# Altium schematic sheet Connectors.SchDoc
size A3; SheetNumber: 5; SheetTotal: 5
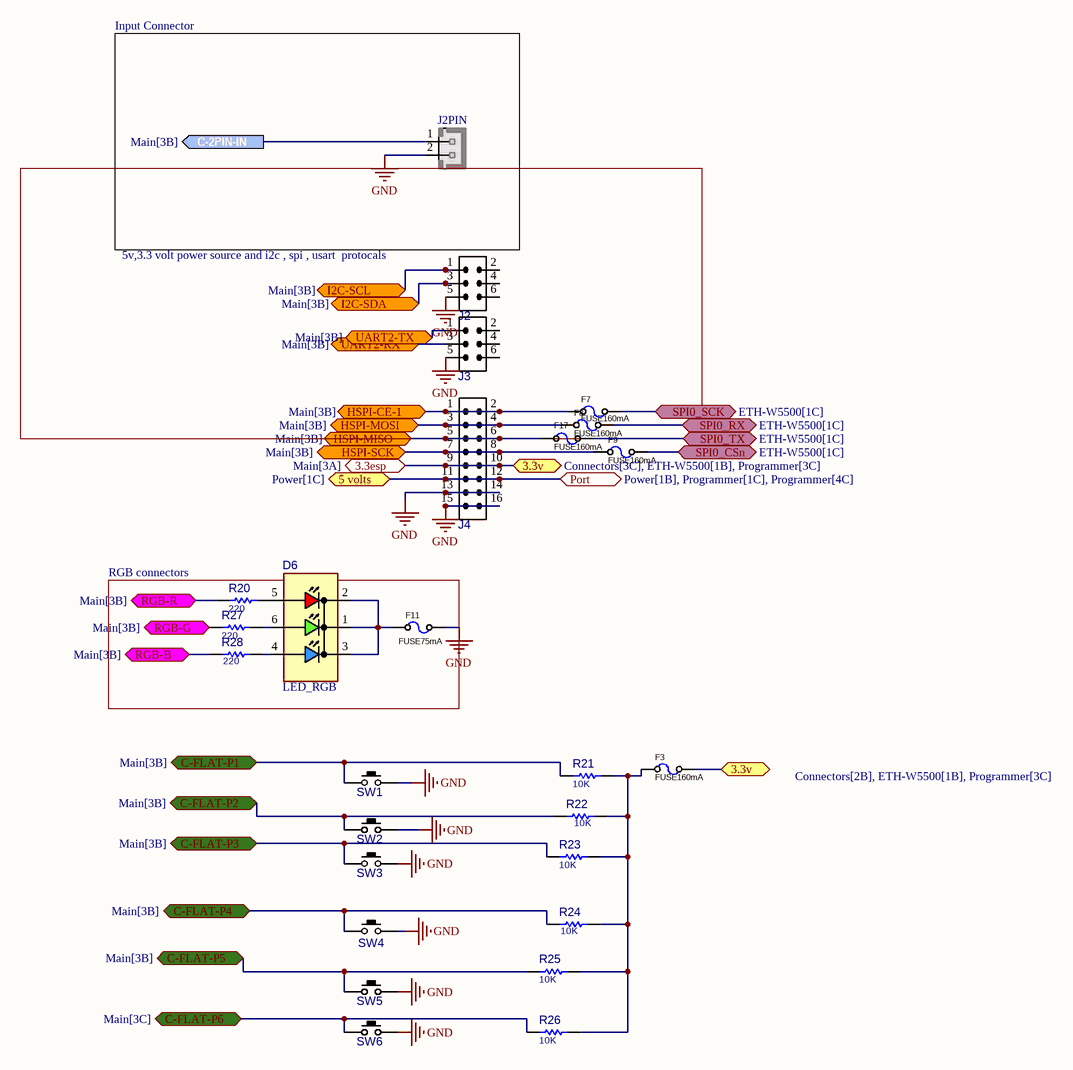
[diagram p0: Connectors.SchDoc]

## Parts
D6  LED_RGB  [LED5050RGB_6]
F3  FUSE160mA  [F1206]
F7  FUSE160mA  [F1206]
F8  FUSE160mA  [F1206]
F9  FUSE160mA  [F1206]
F11  FUSE75mA  [F1206]
F17  FUSE160mA  [F1206]
J2  IDC_2X3  [IDC_2X3]  (value not drawn)
J2PIN  HHDR_2  [XH_2]  (value not drawn)
J3  IDC_2X3  [IDC_2X3]  (value not drawn)
J4  IDC_2X8  [IDC_2X8]  (value not drawn)
R20  220  [R0402]
R21  10K  [R0402]
R22  10K  [R0402]
R23  10K  [R0402]
R24  10K  [R0402]
R25  10K  [R0402]
R26  10K  [R0402]
R27  220  [R0402]
R28  220  [R0402]
SW1  PUSHBUTTON  [SWPBS_SPST_6X3X5]  (value not drawn)
SW2  PUSHBUTTON  [SWPBS_SPST_6X3X5]  (value not drawn)
SW3  PUSHBUTTON  [SWPBS_SPST_6X3X5]  (value not drawn)
SW4  PUSHBUTTON  [SWPBS_SPST_6X3X5]  (value not drawn)
SW5  PUSHBUTTON  [SWPBS_SPST_6X3X5]  (value not drawn)
SW6  PUSHBUTTON  [SWPBS_SPST_6X3X5]  (value not drawn)

## Blocks framed on the sheet
Input Connector: J2PIN
5v,3.3 volt power source and i2c , spi , usart  protocals: F7 F8 F17 J2 J3
RGB connectors: D6 F11 R20 R27 R28

## Ports
3.3esp (bidir, see Main[3A]), 3.3v (bidir, see Connectors[2B], ETH-W5500[1B], Programmer[3C]), 3.3v (bidir, see Connectors[3C], ETH-W5500[1B], Programmer[3C]), 5 volts (bidir, see Power[1C]), C-2PIN-IN (out, see Main[3B]), C-FLAT-P1 (bidir, see Main[3B]), C-FLAT-P2 (bidir, see Main[3B]), C-FLAT-P3 (bidir, see Main[3B]), C-FLAT-P4 (bidir, see Main[3B]), C-FLAT-P5 (bidir, see Main[3B]), C-FLAT-P6 (bidir, see Main[3C]), HSPI-CE-1 (bidir, see Main[3B]), HSPI-MISO (bidir, see Main[3B]), HSPI-MOSI (bidir, see Main[3B]), HSPI-SCK (bidir, see Main[3B]), I2C-SCL (bidir, see Main[3B]), I2C-SDA (bidir, see Main[3B]), Port (bidir, see Power[1B], Programmer[1C], Programmer[4C]), RGB-B (bidir, see Main[3B]), RGB-G (bidir, see Main[3B]), RGB-R (bidir, see Main[3B]), SPI0_CSn (bidir, see ETH-W5500[1C]), SPI0_RX (bidir, see ETH-W5500[1C]), SPI0_SCK (bidir, see ETH-W5500[1C]), SPI0_TX (bidir, see ETH-W5500[1C]), UART2-RX (bidir, see Main[3B]), UART2-TX (bidir, see Main[3B])

## Nets
GND: F11.2 J2.5 J2PIN.2 J3.5 J4.13 J4.14 J4.15 J4.16 SW1.2(P3) SW2.2(P3) SW3.2(P3) SW4.2(P3) SW5.2(P3) SW6.2(P3)
3.3esp: F3.2 J4.9 J4.10 ; port 3.3v, port 3.3esp
5 volts: J4.11 J4.12 ; port 5 volts, port Port
C-2PIN-IN: J2PIN.1 ; port C-2PIN-IN
C-FLAT-P1: R21.1 SW1.1(P1) ; port C-FLAT-P1
C-FLAT-P2: R22.1 SW2.1(P1) ; port C-FLAT-P2
C-FLAT-P3: R23.1 SW3.1(P1) ; port C-FLAT-P3
C-FLAT-P4: R24.1 SW4.1(P1) ; port C-FLAT-P4
C-FLAT-P5: R25.1 SW5.1(P1) ; port C-FLAT-P5
C-FLAT-P6: R26.1 SW6.1(P1) ; port C-FLAT-P6
HSPI-CE-1: F7.2 J4.1 J4.2 ; port HSPI-CE-1
HSPI-MISO: F17.2 J4.5 J4.6 ; port HSPI-MISO
HSPI-MOSI: F8.2 J4.3 J4.4 ; port HSPI-MOSI
HSPI-SCK: F9.2 J4.7 J4.8 ; port HSPI-SCK
I2C-SCL: J2.1 ; port I2C-SCL
I2C-SDA: J2.3 ; port I2C-SDA
RGB-B: R28.1 ; port RGB-B
RGB-G: R27.1 ; port RGB-G
RGB-R: R20.1 ; port RGB-R
SPI0_CSn: F9.1 ; port SPI0_CSn
SPI0_RX: F8.1 ; port SPI0_RX
SPI0_SCK: F7.1 ; port SPI0_SCK
SPI0_TX: F17.1 ; port SPI0_TX
UART2-RX: J3.3 ; port UART2-RX
UART2-TX: J3.1 ; port UART2-TX
NetD6_1: D6.1(RED) D6.2(GRN) D6.3(BLU) F11.1
NetD6_4: D6.4(AB) R28.2
NetD6_5: D6.5(AG) R20.2
NetD6_6: D6.6(AR) R27.2
NetF3_1: F3.1 R21.2 R22.2 R23.2 R24.2 R25.2 R26.2

Not connected (* = marked no-connect by the designer): J2 2 4 6; J3 2 4 6

## Library data of the parts
D6 = LED_SMD_RGB_5050_CC: LED, SMD, RGB COMMON CATHODE; PARAM: 30mA, 120°; DESC: DESCRIPTION; PARAM2: RED2V, GRN3.2V, BLU3.2V; MANF_P#: -; MANF: -; ASSEMBLY: ASSEMBLY; PRICE: 95t@JAVAN; VALUE: LED_RGB
F3 F7-F9 F11 F17 = FUSE_160mA_1206: Fuse, 160mA, 63VDC, 1206, SMD, Fast Acting; PARAM: 160mA; 63VDC; slow-blow; MANF: Holly Fuse; MANF_P#: 12T-0160L; PARAM2: PARAM2
  F3 F7-F9 F17: VALUE: FUSE160mA
  F11: VALUE: FUSE75mA
J2 J3 = IDC_2X3: CONN, IDC, Male, pitch: 2.54mm, 6POS; VALUE: IDC_2X3
J2PIN = XH_2: JST-XH pitch: 2.5mm; VALUE: HHDR_2
J4 = IDC_2X8: CONN, IDC, Male, pitch: 2.54mm, 16POS; VALUE: IDC_2X8
R20-R28 = RES_SMD: RESISTOR, SMD; PARAM: -W; DESC: DESCRIPTION; DIST#: MOUSER; PARAM2: 1%; MANF_P#: -; MANF: -; ASSEMBLY: ASSEMBLY; PRICE: 100= 0.5$
  R20 R27 R28: VALUE: 220
  R21-R26: VALUE: 10K
SW1-SW6 = SWPBS_SPST_6X3X4: SWITCH, PUSH BUTTON, TACTILE, SMD, SPST, 6X3.5X4.3mm; MANF: Panasonic; DESC: DESCRIPTION; MANF_P#: EVQ-PNF04M; VALUE: PUSHBUTTON; ASSEMBLY: ASSEMBLY; PARAM: PARAM; PRICE: PRICE